# EAGLE design 01-mcu (EAGLE 9.0.0)
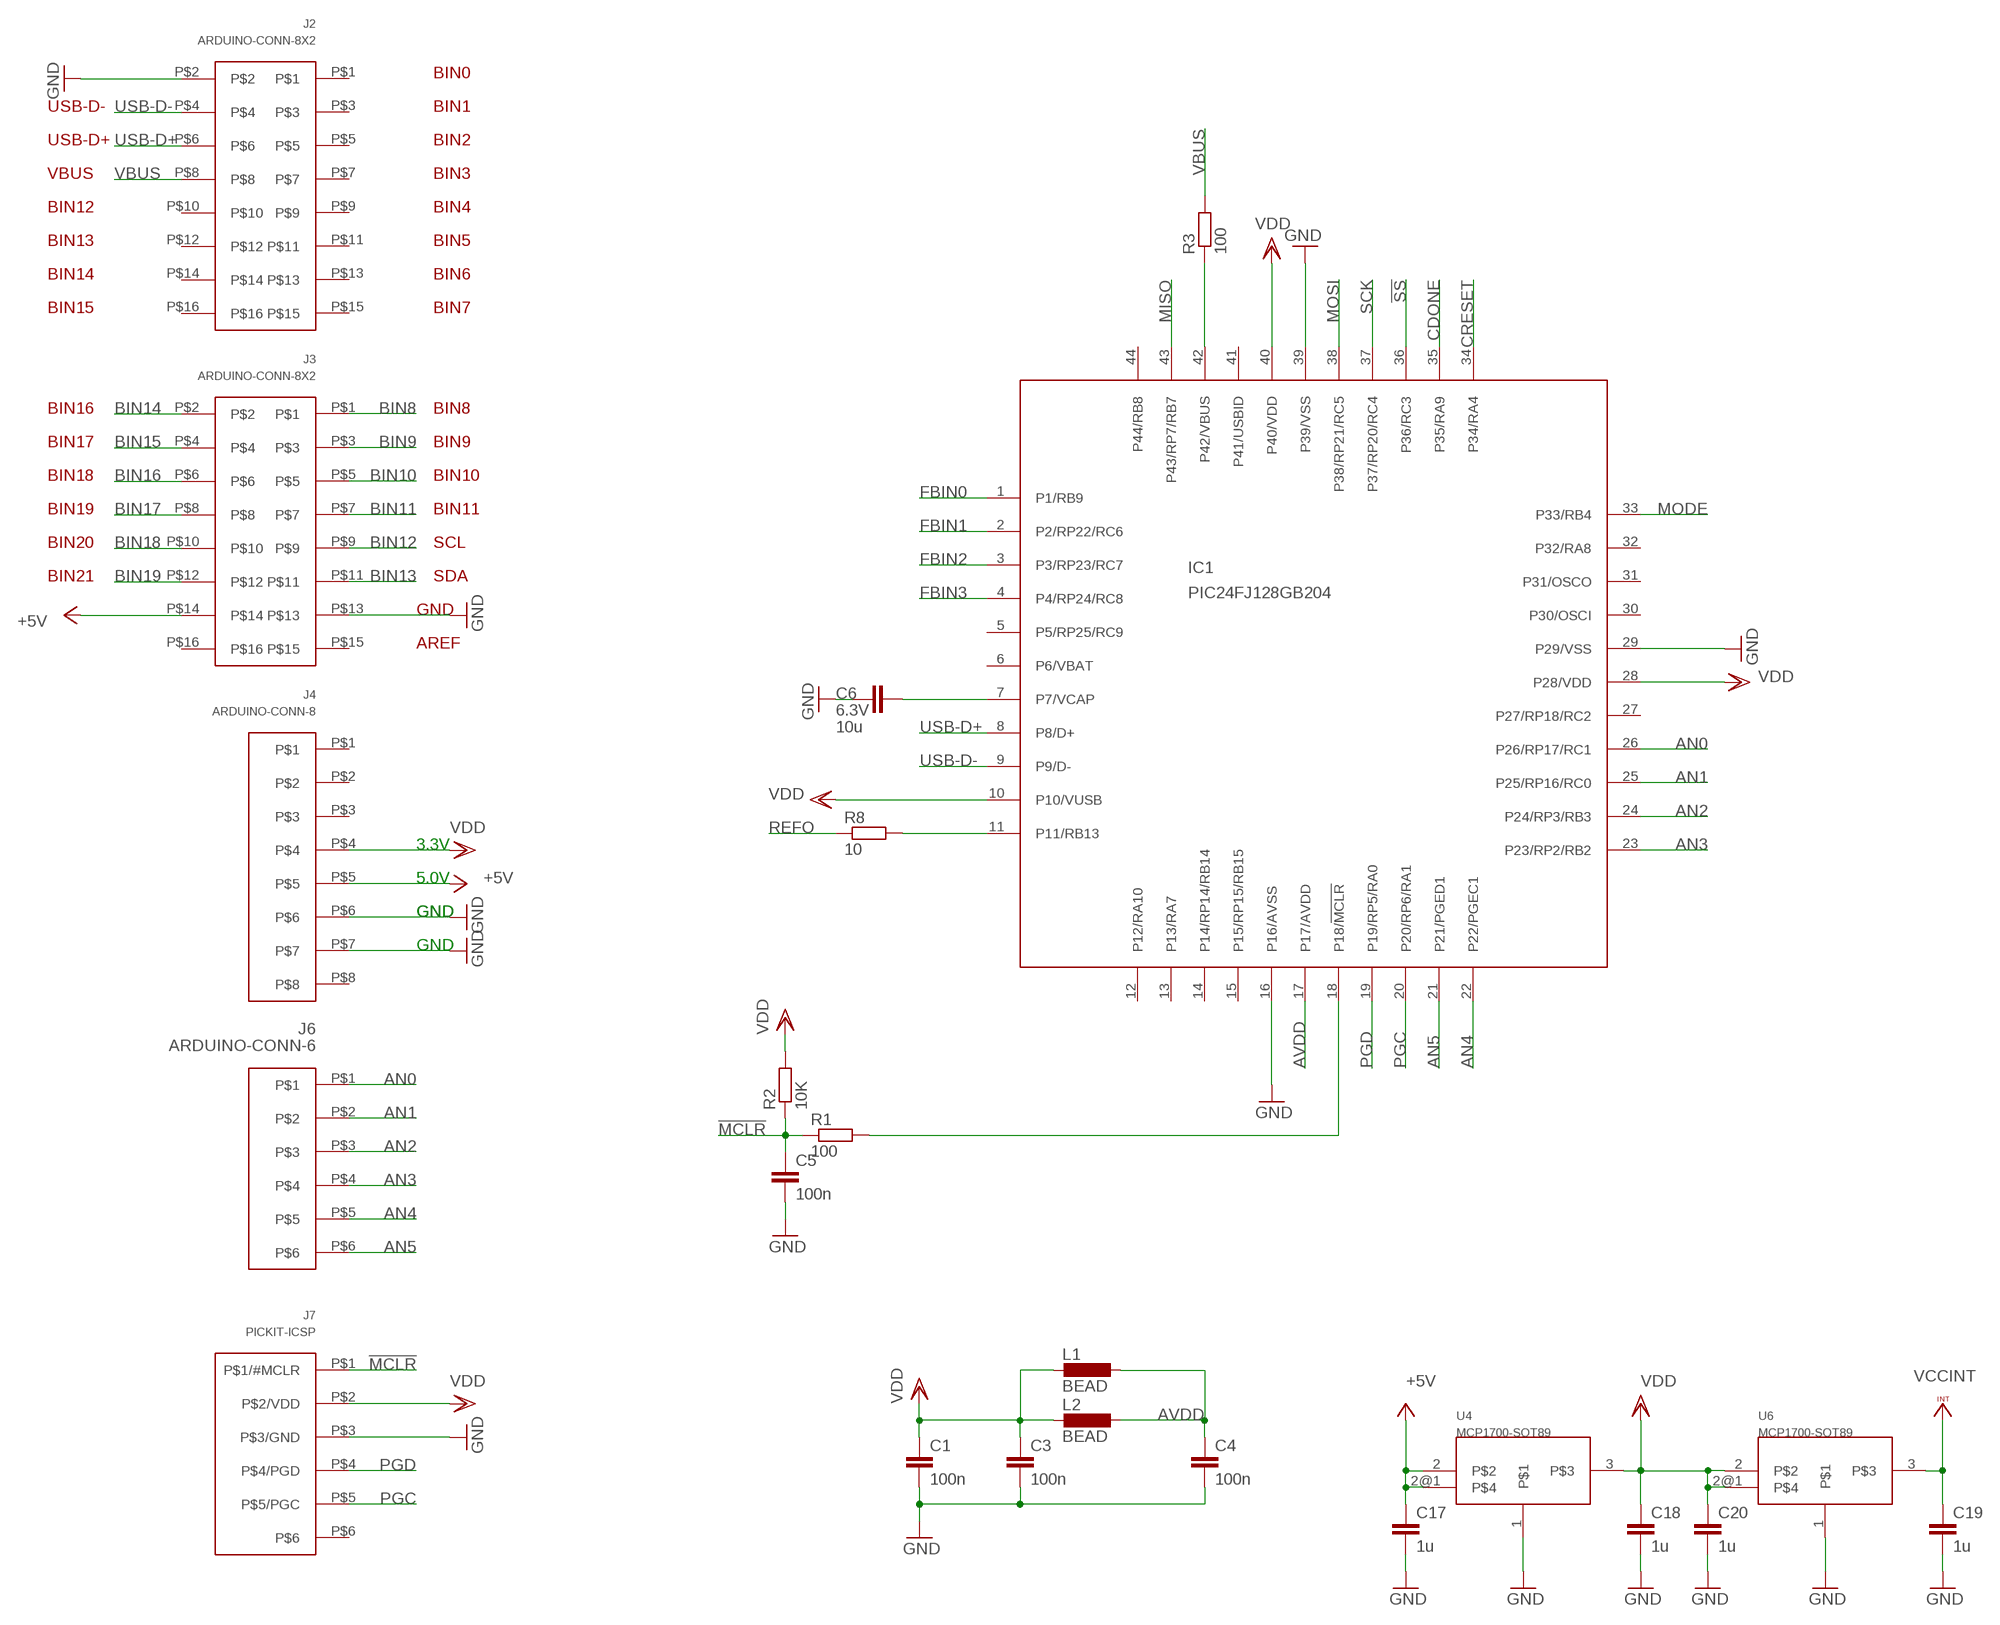
[diagram p0: schematic, sheet 1, part 1 of 2]
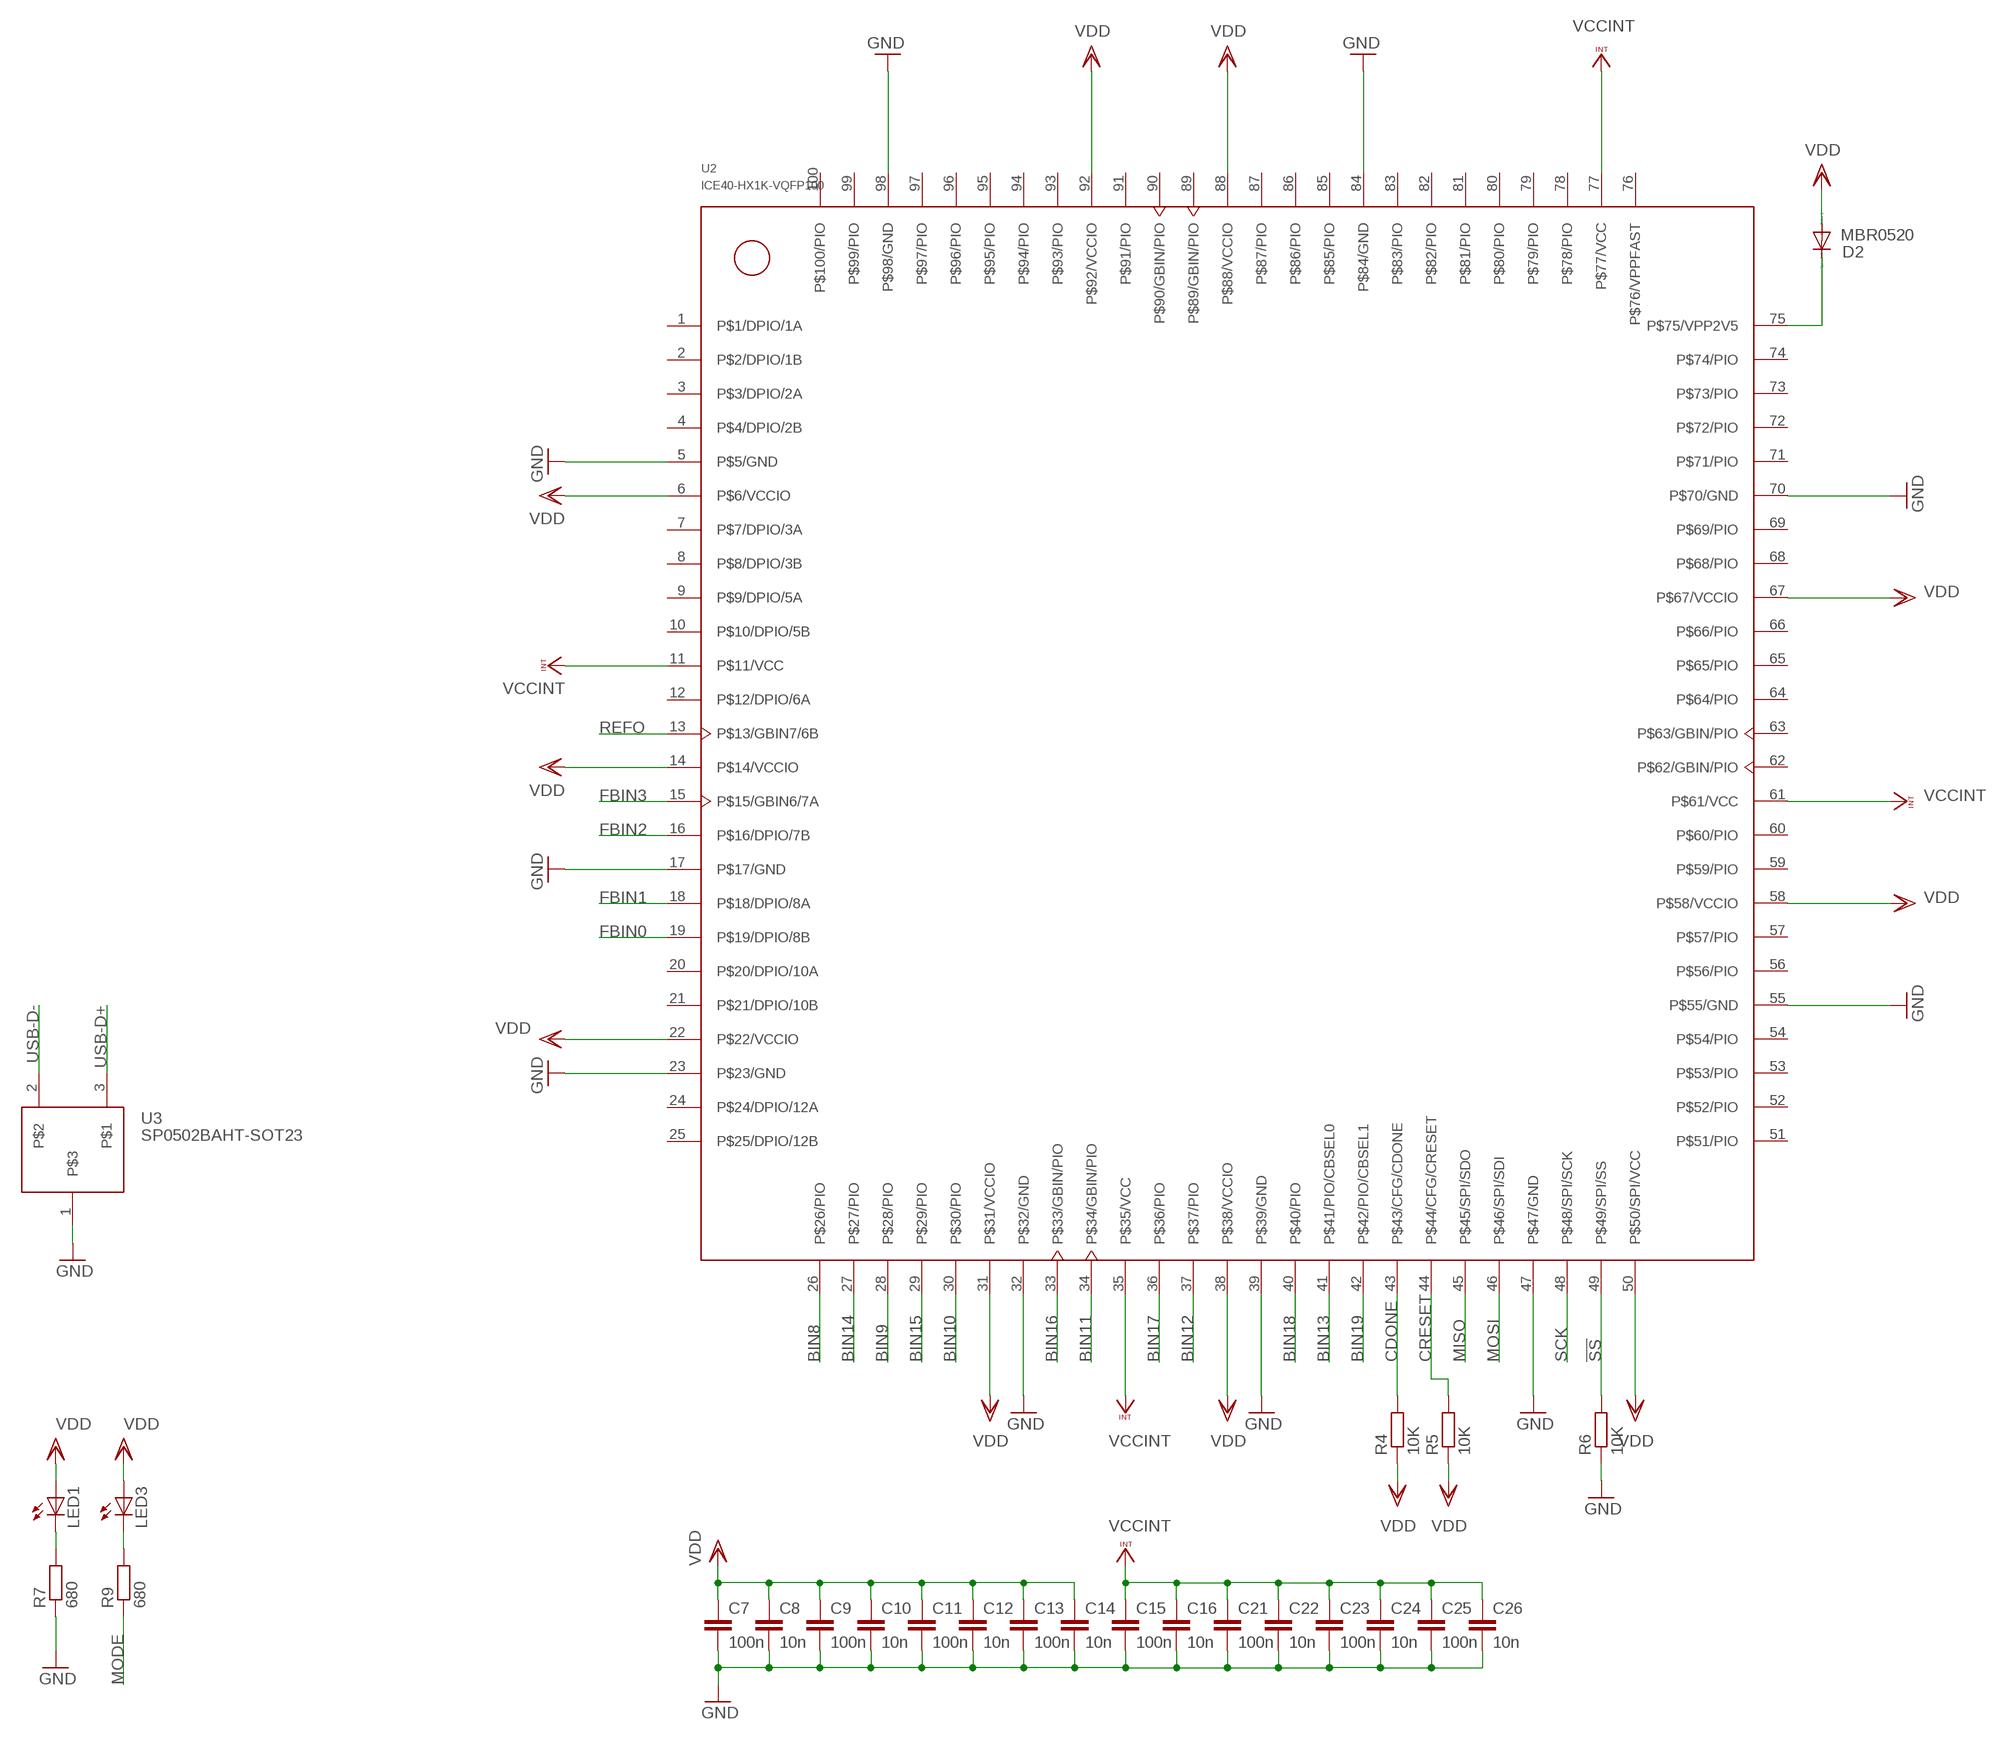
[diagram p1: schematic, sheet 1, part 2 of 2]

## Parts
C1  100n  C-EUC0805  [C0805]
C3  100n  C-EUC0805  [C0805]
C4  100n  C-EUC0805  [C0805]
C5  100n  C-EUC0805  [C0805]
C6  10u  C-EUC0805  [C0805]
C7  100n  C-EUC0805  [C0805]
C8  10n  C-EUC0805  [C0805]
C9  100n  C-EUC0805  [C0805]
C10  10n  C-EUC0805  [C0805]
C11  100n  C-EUC0805  [C0805]
C12  10n  C-EUC0805  [C0805]
C13  100n  C-EUC0805  [C0805]
C14  10n  C-EUC0805  [C0805]
C15  100n  C-EUC0805  [C0805]
C16  10n  C-EUC0805  [C0805]
C17  1u  C-EUC0805  [C0805]
C18  1u  C-EUC0805  [C0805]
C19  1u  C-EUC0805  [C0805]
C20  1u  C-EUC0805  [C0805]
C21  100n  C-EUC0805  [C0805]
C22  10n  C-EUC0805  [C0805]
C23  100n  C-EUC0805  [C0805]
C24  10n  C-EUC0805  [C0805]
C25  100n  C-EUC0805  [C0805]
C26  10n  C-EUC0805  [C0805]
D2  MBR0520  [MBR0520-SOD-123_MINI-SMA]
IC1  PIC24FJ128GB204  [TQFP44]
J2  ARDUINO-CONN-8X2  [ARDUINO-CONN-8X2]
J3  ARDUINO-CONN-8X2  [ARDUINO-CONN-8X2]
J4  ARDUINO-CONN-8  [ARDUINO-CONN-8]
J6  ARDUINO-CONN-6  [ARDUINO-CONN-6]
J7  PICKIT-ICSP  [PICKIT-ICSP]
L1  BEAD  [L0805]
L2  BEAD  [L0805]
LED1  LEDCHIP-LED0805  [CHIP-LED0805]
LED3  LEDCHIP-LED0805  [CHIP-LED0805]
R1  100  R-EU_R0805  [R0805]
R2  10K  R-EU_R0805  [R0805]
R3  100  R-EU_R0805  [R0805]
R4  10K  R-EU_R0805  [R0805]
R5  10K  R-EU_R0805  [R0805]
R6  10K  R-EU_R0805  [R0805]
R7  680  R-EU_R0805  [R0805]
R8  10  R-EU_R0805  [R0805]
R9  680  R-EU_R0805  [R0805]
U2  ICE40-HX1K-VQFP100  [TQFP100-14X14]
U3  SP0502BAHT-SOT23  [SOT23]
U4  MCP1700-SOT89  [MCP1700-SOT89]
U6  MCP1700-SOT89  [MCP1700-SOT89]

## Nets
!MCLR: C5.1 J7.P$1(P$1/#MCLR) R1.1 R2.1
!SS: IC1.36(P36/RC3) R6.2 U2.49(P$49/SPI/SS)
+5V: C17.1 J3.P$14 J4.P$5 U4.2 U4.2@1
AN0: IC1.26(P26/RP17/RC1) J6.P$1
AN1: IC1.25(P25/RP16/RC0) J6.P$2
AN2: IC1.24(P24/RP3/RB3) J6.P$3
AN3: IC1.23(P23/RP2/RB2) J6.P$4
AN4: IC1.22(P22/PGEC1) J6.P$5
AN5: IC1.21(P21/PGED1) J6.P$6
AVDD: C4.1 IC1.17(P17/AVDD) L1.2 L2.2
BIN8: J3.P$1 U2.26(P$26/PIO)
BIN9: J3.P$3 U2.28(P$28/PIO)
BIN10: J3.P$5 U2.30(P$30/PIO)
BIN11: J3.P$7 U2.34(P$34/GBIN/PIO)
BIN12: J3.P$9 U2.37(P$37/PIO)
BIN13: J3.P$11 U2.41(P$41/PIO/CBSEL0)
BIN14: J3.P$2 U2.27(P$27/PIO)
BIN15: J3.P$4 U2.29(P$29/PIO)
BIN16: J3.P$6 U2.33(P$33/GBIN/PIO)
BIN17: J3.P$8 U2.36(P$36/PIO)
BIN18: J3.P$10 U2.40(P$40/PIO)
BIN19: J3.P$12 U2.42(P$42/PIO/CBSEL1)
CDONE: IC1.35(P35/RA9) R4.2 U2.43(P$43/CFG/CDONE)
CRESET: IC1.34(P34/RA4) R5.2 U2.44(P$44/CFG/CRESET)
FBIN0: IC1.1(P1/RB9) U2.19(P$19/DPIO/8B)
FBIN1: IC1.2(P2/RP22/RC6) U2.18(P$18/DPIO/8A)
FBIN2: IC1.3(P3/RP23/RC7) U2.16(P$16/DPIO/7B)
FBIN3: IC1.4(P4/RP24/RC8) U2.15(P$15/GBIN6/7A)
GND: C1.2 C3.2 C4.2 C5.2 C6.1 C7.2 C8.2 C9.2 C10.2 C11.2 C12.2 C13.2 C14.2 C15.2 C16.2 C17.2 C18.2 C19.2 C20.2 C21.2 C22.2 C23.2 C24.2 C25.2 C26.2 IC1.16(P16/AVSS) IC1.29(P29/VSS) IC1.39(P39/VSS) J2.P$2 J3.P$13 J4.P$6 J4.P$7 J7.P$3(P$3/GND) R6.1 R7.1 U2.5(P$5/GND) U2.17(P$17/GND) U2.23(P$23/GND) U2.32(P$32/GND) U2.39(P$39/GND) U2.47(P$47/GND) U2.55(P$55/GND) U2.70(P$70/GND) U2.84(P$84/GND) U2.98(P$98/GND) U3.1 U4.1 U6.1
MISO: IC1.43(P43/RP7/RB7) U2.45(P$45/SPI/SDO)
MODE: IC1.33(P33/RB4) R9.1
MOSI: IC1.38(P38/RP21/RC5) U2.46(P$46/SPI/SDI)
N$1: IC1.42(P42/VBUS) R3.1
N$2: D2.C U2.75(P$75/VPP2V5)
N$3: IC1.18(P18/!MCLR) R1.2
N$4: IC1.11(P11/RB13) R8.2
N$5: C6.2 IC1.7(P7/VCAP)
N$8: LED1.C R7.2
N$11: LED3.C R9.2
PGC: IC1.20(P20/RP6/RA1) J7.P$5(P$5/PGC)
PGD: IC1.19(P19/RP5/RA0) J7.P$4(P$4/PGD)
REFO: R8.1 U2.13(P$13/GBIN7/6B)
SCK: IC1.37(P37/RP20/RC4) U2.48(P$48/SPI/SCK)
USB-D+: IC1.8(P8/D+) J2.P$6 U3.3
USB-D-: IC1.9(P9/D-) J2.P$4 U3.2
VBUS: J2.P$8 R3.2
VCCINT: C15.1 C16.1 C19.1 C21.1 C22.1 C23.1 C24.1 C25.1 C26.1 U2.11(P$11/VCC) U2.35(P$35/VCC) U2.61(P$61/VCC) U2.77(P$77/VCC) U6.3
VDD: C1.1 C3.1 C7.1 C8.1 C9.1 C10.1 C11.1 C12.1 C13.1 C14.1 C18.1 C20.1 D2.A IC1.10(P10/VUSB) IC1.28(P28/VDD) IC1.40(P40/VDD) J4.P$4 J7.P$2(P$2/VDD) L1.1 L2.1 LED1.A LED3.A R2.2 R4.1 R5.1 U2.6(P$6/VCCIO) U2.14(P$14/VCCIO) U2.22(P$22/VCCIO) U2.31(P$31/VCCIO) U2.38(P$38/VCCIO) U2.50(P$50/SPI/VCC) U2.58(P$58/VCCIO) U2.67(P$67/VCCIO) U2.88(P$88/VCCIO) U2.92(P$92/VCCIO) U4.3 U6.2 U6.2@1
Unconnected: IC1.5(P5/RP25/RC9) IC1.6(P6/VBAT) IC1.12(P12/RA10) IC1.13(P13/RA7) IC1.14(P14/RP14/RB14) IC1.15(P15/RP15/RB15) IC1.27(P27/RP18/RC2) IC1.30(P30/OSCI) IC1.31(P31/OSCO) IC1.32(P32/RA8) IC1.41(P41/USBID) IC1.44(P44/RB8) J2.P$1 J2.P$3 J2.P$5 J2.P$7 J2.P$9 J2.P$10 J2.P$11 J2.P$12 J2.P$13 J2.P$14 J2.P$15 J2.P$16 J3.P$15 J3.P$16 J4.P$1 J4.P$2 J4.P$3 J4.P$8 J7.P$6 U2.1(P$1/DPIO/1A) U2.2(P$2/DPIO/1B) U2.3(P$3/DPIO/2A) U2.4(P$4/DPIO/2B) U2.7(P$7/DPIO/3A) U2.8(P$8/DPIO/3B) U2.9(P$9/DPIO/5A) U2.10(P$10/DPIO/5B) U2.12(P$12/DPIO/6A) U2.20(P$20/DPIO/10A) U2.21(P$21/DPIO/10B) U2.24(P$24/DPIO/12A) U2.25(P$25/DPIO/12B) U2.51(P$51/PIO) U2.52(P$52/PIO) U2.53(P$53/PIO) U2.54(P$54/PIO) U2.56(P$56/PIO) U2.57(P$57/PIO) U2.59(P$59/PIO) U2.60(P$60/PIO) U2.62(P$62/GBIN/PIO) U2.63(P$63/GBIN/PIO) U2.64(P$64/PIO) U2.65(P$65/PIO) U2.66(P$66/PIO) U2.68(P$68/PIO) U2.69(P$69/PIO) U2.71(P$71/PIO) U2.72(P$72/PIO) U2.73(P$73/PIO) U2.74(P$74/PIO) U2.76(P$76/VPPFAST) U2.78(P$78/PIO) U2.79(P$79/PIO) U2.80(P$80/PIO) U2.81(P$81/PIO) U2.82(P$82/PIO) U2.83(P$83/PIO) U2.85(P$85/PIO) U2.86(P$86/PIO) U2.87(P$87/PIO) U2.89(P$89/GBIN/PIO) U2.90(P$90/GBIN/PIO) U2.91(P$91/PIO) U2.93(P$93/PIO) U2.94(P$94/PIO) U2.95(P$95/PIO) U2.96(P$96/PIO) U2.97(P$97/PIO) U2.99(P$99/PIO) U2.100(P$100/PIO)

## Notes on the sheet
- BIN0
- USB-D- | BIN1
- USB-D+ | BIN2
- VBUS | BIN3
- BIN12 | BIN4
- BIN13 | BIN5
- BIN14 | BIN6
- BIN15 | BIN7
- BIN16 | BIN8
- BIN17 | BIN9
- BIN18 | BIN10
- BIN19 | BIN11
- BIN20 | SCL
- BIN21 | SDA
- GND
- AREF
- 3.3V
- 5.0V
- GND | GND
- GND

## Library data of the parts
C1 C3-C5 C7-C26 = rcl:C-EU: CAPACITOR, European symbol; SPICEPREFIX: C
C6 = rcl:C-EU: CAPACITOR, European symbol; RATING: 6.3V; SPICEPREFIX: C
D2 = MIDI router MCU parts:MBR0520
IC1 = MIDI router MCU parts:PIC24FJ128GB204: PIC24FJ64GA00416-bit microcontroller Auto generated by make-symbol-device-package-bsdl.ulp Rev. 25 Source: PIC24FJ64GA004.bsd
J2 J3 = MIDI router MCU parts:ARDUINO-CONN-8X2
J4 = MIDI router MCU parts:ARDUINO-CONN-8
J6 = MIDI router MCU parts:ARDUINO-CONN-6
J7 = MIDI router MCU parts:PICKIT-ICSP
L1 L2 = MIDI router MCU parts:BEAD
LED1 LED3 = MIDI router MCU parts:LED: LED OSRAM: - CHIPLED LG R971, LG N971, LY N971, LG Q971, LY Q971, LO R971, LY R971 LH N974, LH R974 LS Q976, LO Q976, LY Q976 LO Q996 - Hyper CHIPLED LW Q18S LB Q993, LB Q99A, LB R99A - SideLED LS A670, LO A670, LY A670, LG A670, LP A670 LB A673, LV A673, LT A673, LW A673 LH A674 LY A675 LS A676, LA A676, LO A676, LY A676, LW A676 LS A679, LY A679, LG A679 - Hyper Micro SIDELED® LS Y876, LA Y876, LO Y876, LY Y876 LT Y87S - SmartLED LW L88C, LW L88S LB L89C, LB L89S, LG L890 LS L89K, LO L89K, LY L89K LS L896, LA L896, LO L896, LY L896 - TOPLED LS T670, LO T670, LY T670, LG T670, LP T670 LSG T670, LSP T670, LSY T670, LOP T670, LYG T670 LG T671, LOG T671, LSG T671 LB T673, LV T673, LT T673, LW T673 LH T674 LS T676, LA T676, LO T676, LY T676, LB T676, LH T676, LSB T676, LW T676 LB T67C, LV T67C, LT T67C, LS T67K, LO T67K, LY T67K, LW E67C LS E67B, LA E67B, LO E67B, LY E67B, LB E67C, LV E67C, LT E67C LW T67C LS T679, LY T679, LG T679 LS T770, LO T770, LY T770, LG T770, LP T770 LB T773, LV T773, LT T773, LW T773 LH T774 LS E675, LA E675, LY E675, LS T675 LS T776, LA T776, LO T776, LY T776, LB T776 LHGB T686 LT T68C, LB T68C - Hyper Mini TOPLED® LB M676 - Mini TOPLED Santana® LG M470 LS M47K, LO M47K, LY M47K Source: http://www.osram.convergy.de LUXEON: - LUMILED® LXK2-PW12-R00, LXK2-PW12-S00, LXK2-PW14-U00, LXK2-PW14-V00 LXK2-PM12-R00, LXK2-PM12-S00, LXK2-PM14-U00 LXK2-PE12-Q00, LXK2-PE12-R00, LXK2-PE12-S00, LXK2-PE14-T00, LXK2-PE14-U00 LXK2-PB12-K00, LXK2-PB12-L00, LXK2-PB12-M00, LXK2-PB14-N00, LXK2-PB14-P00, LXK2-PB14-Q00 LXK2-PR12-L00, LXK2-PR12-M00, LXK2-PR14-Q00, LXK2-PR14-R00 LXK2-PD12-Q00, LXK2-PD12-R00, LXK2-PD12-S00 LXK2-PH12-R00, LXK2-PH12-S00 LXK2-PL12-P00, LXK2-PL12-Q00, LXK2-PL12-R00 Source: www.luxeon.com KINGBRIGHT: KA-3528ASYC Source: www.kingbright.com
R1-R9 = rcl:R-EU_: RESISTOR, European symbol
U2 = MIDI router MCU parts:ICE40-HX1K-VQFP100
U3 = MIDI router MCU parts:SP0502BAHT-SOT23
U4 U6 = MIDI router MCU parts:MCP1700-SOT89

## Board
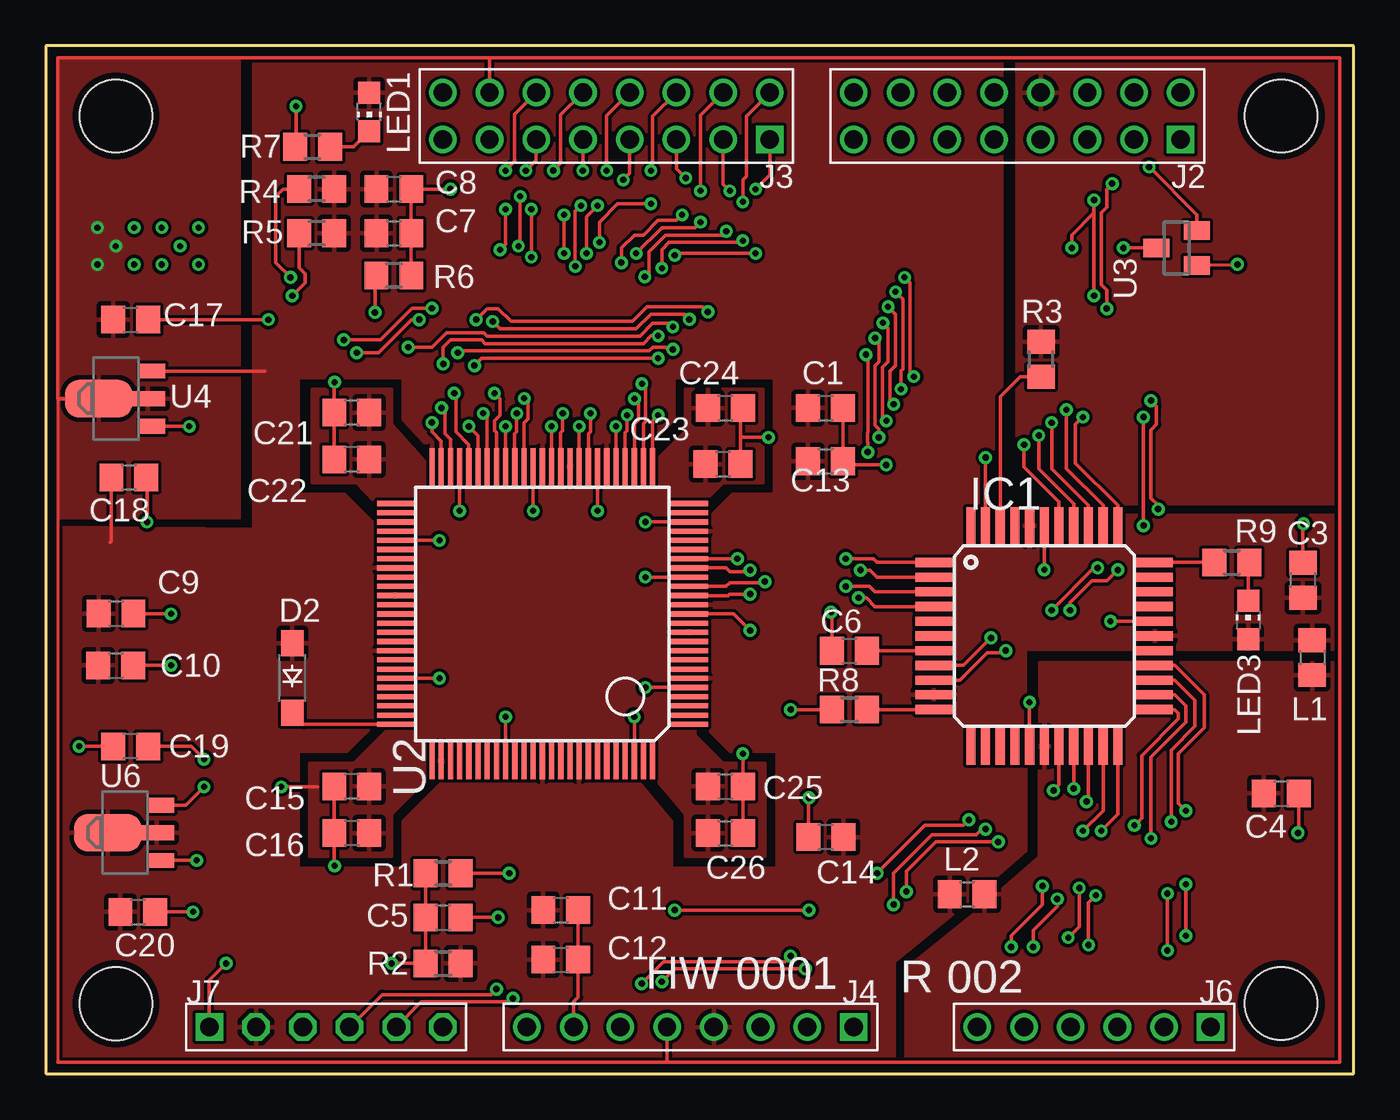
[diagram p2: board, top side]
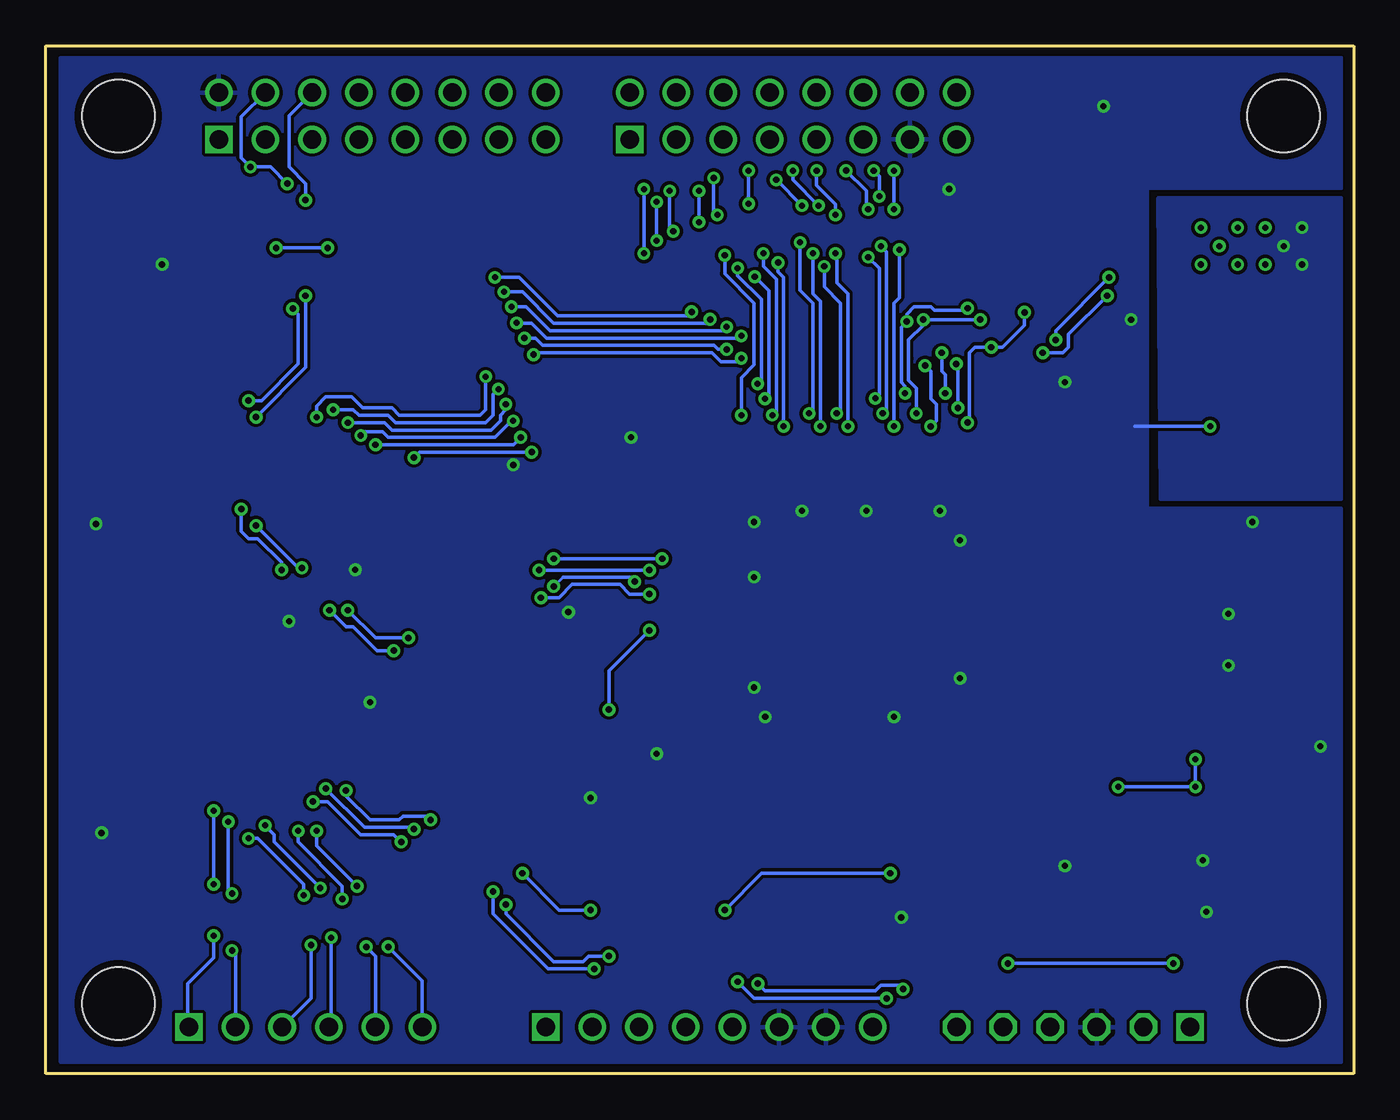
[diagram p3: board, bottom side, seen from below]

Size 71.12 x 55.88 mm. Coordinates in mm from the lower left corner, seen from the top.
Outline: 0,0 71.12,0 71.12,55.88 0,55.88 0,0
Copper layers (1*16): Top 0.0356mm / dielectric 1.5011mm / Bottom 0.0356mm
Design rules "LaenPCBOrder-custom": minimum track width 6mil, minimum drill 13mil, track to track 7mil, track to pad 7mil, pad to pad 7mil, via to via 7mil, smd to smd 7mil, copper to edge 15mil, drill to drill 6mil, minimum pad ring 7mil, minimum via ring 7mil, stop-mask expansion 3mil, vias tented up to drill 0mil, thermal gap 10mil
Holes 3.96 mm at 3.81,52.07 3.81,3.81 67.18,3.82 67.18,52.07

### Footprints (pad centres in the part's own frame; a part is rotated, then mirrored left to right if it is on the bottom)
C0805 = smd 1.3 x 1.5: 1 -0.95,0; 2 0.95,0
MBR0520-SOD-123_MINI-SMA = smd 1.422 x 1.219: A 1.778,0; C -2.007,0
TQFP44 = smd 2 x 0.5: 1 -6,4; 2 -6,3.2; 3 -6,2.4; 4 -6,1.6; 5 -6,0.8; 6 -6,0; 7 -6,-0.8; 8 -6,-1.6; 9 -6,-2.4; 10 -6,-3.2; 11 -6,-4; 23 6,-4; 24 6,-3.2; 25 6,-2.4; 26 6,-1.6; 27 6,-0.8; 28 6,0; 29 6,0.8; 30 6,1.6; 31 6,2.4; 32 6,3.2; 33 6,4 | smd 0.5 x 2: 12 -4,-6; 13 -3.2,-6; 14 -2.4,-6; 15 -1.6,-6; 16 -0.8,-6; 17 0,-6; 18 0.8,-6; 19 1.6,-6; 20 2.4,-6; 21 3.2,-6; 22 4,-6; 34 4,6; 35 3.2,6; 36 2.4,6; 37 1.6,6; 38 0.8,6; 39 0,6; 40 -0.8,6; 41 -1.6,6; 42 -2.4,6; 43 -3.2,6; 44 -4,6
ARDUINO-CONN-8X2 = drill 1 square: P$1 0,0 | drill 1: P$2 0,-2.54; P$3 2.54,0; P$4 2.54,-2.54; P$5 5.08,0; P$6 5.08,-2.54; P$7 7.62,0; P$8 7.62,-2.54; P$9 10.16,0; P$10 10.16,-2.54; P$11 12.7,0; P$12 12.7,-2.54; P$13 15.24,0; P$14 15.24,-2.54; P$15 17.78,0; P$16 17.78,-2.54
ARDUINO-CONN-8 = drill 1 square: P$1 0,0 | drill 1: P$2 2.54,0; P$3 5.08,0; P$4 7.62,0; P$5 10.16,0; P$6 12.7,0; P$7 15.24,0; P$8 17.78,0
ARDUINO-CONN-6 = drill 1 square: P$1 0,0 | drill 1: P$2 2.54,0; P$3 5.08,0; P$4 7.62,0; P$5 10.16,0; P$6 12.7,0
PICKIT-ICSP = drill 1 square: P$1 0,0 | drill 1 octagon: P$2 0,-2.54; P$3 0,-5.08; P$4 0,-7.62; P$5 0,-10.16; P$6 0,-12.7
L0805 = smd 1.3 x 1.5: 1 -0.95,0; 2 0.95,0
CHIP-LED0805 = smd 1.2 x 1.2: A 0,-1.05; C 0,1.05
R0805 = smd 1.3 x 1.5: 1 -0.95,0; 2 0.95,0
TQFP100-14X14 = smd 0.28 x 2: 1 -6,-8; 2 -5.5,-8; 3 -5,-8; 4 -4.5,-8; 5 -4,-8; 6 -3.5,-8; 7 -3,-8; 8 -2.5,-8; 9 -2,-8; 10 -1.5,-8; 11 -1,-8; 12 -0.5,-8; 13 0,-8; 14 0.5,-8; 15 1,-8; 16 1.5,-8; 17 2,-8; 18 2.5,-8; 19 3,-8; 20 3.5,-8; 21 4,-8; 22 4.5,-8; 23 5,-8; 24 5.5,-8; 25 6,-8; 51 6,8; 52 5.5,8; 53 5,8; 54 4.5,8; 55 4,8; 56 3.5,8; 57 3,8; 58 2.5,8; 59 2,8; 60 1.5,8; 61 1,8; 62 0.5,8; 63 0,8; 64 -0.5,8; 65 -1,8; 66 -1.5,8; 67 -2,8; 68 -2.5,8; 69 -3,8; 70 -3.5,8; 71 -4,8; 72 -4.5,8; 73 -5,8; 74 -5.5,8; 75 -6,8 | smd 2 x 0.28: 26 8,-6; 27 8,-5.5; 28 8,-5; 29 8,-4.5; 30 8,-4; 31 8,-3.5; 32 8,-3; 33 8,-2.5; 34 8,-2; 35 8,-1.5; 36 8,-1; 37 8,-0.5; 38 8,0; 39 8,0.5; 40 8,1; 41 8,1.5; 42 8,2; 43 8,2.5; 44 8,3; 45 8,3.5; 46 8,4; 47 8,4.5; 48 8,5; 49 8,5.5; 50 8,6; 76 -8,6; 77 -8,5.5; 78 -8,5; 79 -8,4.5; 80 -8,4; 81 -8,3.5; 82 -8,3; 83 -8,2.5; 84 -8,2; 85 -8,1.5; 86 -8,1; 87 -8,0.5; 88 -8,0; 89 -8,-0.5; 90 -8,-1; 91 -8,-1.5; 92 -8,-2; 93 -8,-2.5; 94 -8,-3; 95 -8,-3.5; 96 -8,-4; 97 -8,-4.5; 98 -8,-5; 99 -8,-5.5; 100 -8,-6
SOT23 = smd 1 x 1.4: 1 -0.95,-1.1; 2 0.95,-1.1; 3 0,1.1
MCP1700-SOT89 = smd 0.8 x 1.4: 1 -1.499,-1.981; 3 1.499,-1.981 | smd 0.8 x 1.9: 2 0,-1.727 | smd 2.032 x 3.65: 2@1 0,0.94

### Placement (x,y rotation side)
C1  42.4,36.2 0 top
C3  68.37,26.84 90 top
C4  67.18,15.24 0 top
C5  21.6,8.5 0 top
C6  43.7,23 0 top
C7  18.92,45.7 0 top
C8  18.92,48.1 0 top
C9  3.81,25.02 0 top
C10  3.8,22.2 0 top
C11  28,8.9 0 top
C12  28,6.2 0 top
C13  42.4,33.3 0 top
C14  42.42,12.86 180 top
C15  16.64,15.62 180 top
C16  16.64,13.08 180 top
C17  4.6,41 0 top
C18  4.51,32.43 0 top
C19  4.6,17.8 180 top
C20  5,8.8 0 top
C21  16.64,35.94 180 top
C22  16.64,33.4 180 top
C23  36.83,33.15 0 top
C24  36.96,36.2 0 top
C25  36.96,15.62 0 top
C26  36.96,13.08 0 top
D2  13.4,21.63 90 top
IC1  54.3,23.8 0 top
J2  61.72,50.8 180 top
J3  39.37,50.8 180 top
J4  43.94,2.54 180 top
J6  63.35,2.54 180 top
J7  8.89,2.54 90 top
L1  68.87,22.63 270 top
L2  50.1,9.76 0 top
LED1  17.59,52.3 180 top
LED3  65.39,24.67 0 top
R1  21.6,10.9 0 top
R2  21.6,6 0 top
R3  54.12,38.85 90 top
R4  14.72,48.1 180 top
R5  14.72,45.7 180 top
R6  18.92,43.4 180 top
R7  14.5,50.4 0 top
R8  43.7,19.8 0 top
R9  64.5,27.8 0 top
U2  27,25 90 top
U3  61.5,44.9 90 top
U4  3.81,36.7 90 top
U6  4.3,13.1 90 top

### Tracks (layer width: path | path; a pad name or v marks a point on that pad's centre or on a via)
!MCLR  (via drill 0.35)
  Top 0.178: J7.P$1 8.89,5.09 v9.8,6 | v18.8,6 R2.1 C5.1 R1.1
  Bottom 0.178: v9.8,6 v18.8,6
!SS  (via drill 0.33, 0.35)
  Top 0.178: IC1.36 56.7,30.9 54.7,32.9 v54.7,35.4 | v46.11,36.4 45.9,36.61 45.9,38.2 46.2,38.5 46.2,41.3 v45.8,41.7 | v34.1,40.61 33.91,40.8 33,40.8 32.3,40.1 24,40.1 23.8,40.3 21.8,40.3 21,39.5 v19.7,39.5 | U2.49 21.5,34.4 21,34.9 v21,35.4 | R6.2 17.9,43.33 v17.9,41.4
  Bottom 0.178: v54.7,35.4 52.7,35.4 52.3,35 46.9,35 46.4,35.5 46.4,35.8 46.11,36.09 v46.11,36.4 | v45.8,41.7 45,41.7 43.7,40.4 34.31,40.4 v34.1,40.61 | v21,35.4 20.9,35.5 20.9,39.2 20.6,39.5 v19.7,39.5 19.1,39.5 17.9,40.7 v17.9,41.4
+5V  (via drill 0.33)
  Top 0.152: 0.64,36.7 0.64,0.64
  Top 0.178: J3.P$14 24.13,55.24 | 24.13,55.24 0.64,55.24 0.64,36.7 U4.2@1 | 0.64,0.64 33.8,0.64 | 33.8,0.64 70.36,0.64 70.36,55.24 24.13,55.24 | J4.P$5 33.78,0.65 33.8,0.64
  other vias: 3.8,45 2.8,46 2.8,44
  pour Top: 10.54,55.24 0.64,55.24 0.64,30.23 10.54,30.23
  pour Bottom: 0.64,47.62 10.67,47.62 10.54,31.24 0.64,31.24
+5V1  (via drill 0.33)
  other vias: 4.8,46 4.8,44
+5V2  (via drill 0.33)
  other vias: 7.3,45 6.3,46 6.3,44
+5V3  (via drill 0.33)
  other vias: 8.3,46 8.3,44
AN0  (via drill 0.33)
  Top 0.178: IC1.26 61.4,22.2 63,20.6 63,18.8 61.6,17.4 61.6,14.7 v62,14.3 | v62,10.3 v62,7.5
  Bottom 0.178: v62,14.3 v62,10.3 | v62,7.5 62,6.3 63.4,4.9 63.4,2.59 J6.P$1
AN1  (via drill 0.33)
  Top 0.178: IC1.25 61.4,21.4 62.5,20.3 62.5,18.9 61.2,17.6 v61.2,13.7 | v61,9.8 v61,6.7
  Bottom 0.178: v61.2,13.7 61.2,10 v61,9.8 | v61,6.7 60.81,6.51 J6.P$2
AN2  (via drill 0.33)
  Top 0.178: IC1.24 61.4,20.6 62,20 62,19.1 60.1,17.2 v60.1,12.8 | v57.1,9.7 56.7,9.3 v56.7,7
  Bottom 0.178: v60.1,12.8 59.6,12.8 57.1,10.3 v57.1,9.7 | v56.7,7 56.7,4.11 J6.P$3
AN3  (via drill 0.33)
  Top 0.178: IC1.23 61.4,19.8 61.6,19.6 61.6,19.3 59.6,17.3 59.6,13.9 v59.2,13.5 | v56.2,10.1 56.2,8 v55.6,7.4
  Bottom 0.178: v56.2,10.1 58.7,12.6 58.7,13 v59.2,13.5 | v55.6,7.4 55.6,2.67 J6.P$4
AN4  (via drill 0.33, 0.35)
  Top 0.178: IC1.22 58.3,14.1 v57.4,13.2 | v53.7,6.9 53.7,7.8 55,9.1 v55,9.5
  Bottom 0.178: J6.P$5 53.19,6.39 v53.7,6.9 | v55,9.5 55,10.2 57.4,12.6 v57.4,13.2
AN5  (via drill 0.33, 0.35)
  Top 0.178: IC1.21 57.5,14.3 v56.4,13.2 | v52.5,6.9 52.5,7.5 54.2,9.2 v54.2,10.2
  Bottom 0.178: J6.P$6 50.65,5.05 v52.5,6.9 | v54.2,10.2 56.4,12.4 v56.4,13.2
AVDD
  pour Top: 46.78,0.64 46.78,5.71 50.43,8.66 54.03,11.8 54.07,22.34 70.36,22.34 70.36,0.64
BIN8  (via drill 0.33)
  Top 0.178: U2.26 33,35.5 v33.3,35.8 | J3.P$1 39.37,48.87 v38.6,48.1 | v38.6,44.6 34.3,44.6 v34.2,44.5
  Bottom 0.178: v33.3,35.8 33.3,37.85 32.6,38.55 32.6,41.9 34.2,43.5 v34.2,44.5 | v38.6,48.1 v38.6,44.6
BIN9  (via drill 0.33)
  Top 0.178: U2.28 32,35.34 32.22,35.56 32.22,36.49 v32.01,36.7 | J3.P$3 36.83,48.37 v37.2,48 | v37,45.81 36.79,45.6 33.7,45.6 32.8,44.7 32.8,43.56 v32.57,43.33
  Bottom 0.178: v32.01,36.7 31.8,36.91 31.8,42.56 v32.57,43.33 | v37.2,48 37.2,46.01 v37,45.81
BIN10  (via drill 0.33, 0.35)
  Top 0.178: U2.30 v31,35.2 | J3.P$5 34.29,49.21 v34.8,48.7 | v34.6,46.7 34.3,46.4 33.3,46.4 32.5,45.6 32,45.6 31.3,44.9 v31.3,44.1
  Bottom 0.178: v34.8,48.7 34.8,46.9 v34.6,46.7 | v31.3,44.1 31.3,43.6 31,43.3 v31,35.2
BIN11  (via drill 0.33)
  Top 0.178: U2.34 v29,35.2 | J3.P$7 31.75,48.95 v31.4,48.6 | v30,47.2 29.4,46.6 v29.4,44.6
  Bottom 0.178: v31.4,48.6 v30,47.2 | v29.4,44.6 29.4,42.4 29,42 v29,35.2
BIN12  (via drill 0.33)
  Top 0.178: U2.37 v27.5,35.2 | J3.P$9 v29.2,49.1 | v28.18,46.7 v28.18,44.6
  Bottom 0.178: v29.2,49.1 29.2,48.3 28.18,47.28 v28.18,46.7 | v27.5,35.2 27.5,42.42 28.1,43.02 28.1,44.52 v28.18,44.6
BIN13  (via drill 0.33)
  Top 0.178: v25.61,35.9 v25.6,35.89 25.6,35.46 25.61,35.45 25.61,34.91 25.5,34.8 U2.41 | J3.P$11 26.67,49.67 v26.1,49.1 | v25.79,47.7 25.79,45.09 v25.7,45
  Bottom 0.178: v25.61,35.9 25.4,36.11 25.4,44.7 v25.7,45 | v26.1,49.1 25.79,48.79 v25.79,47.7
BIN14  (via drill 0.33)
  Top 0.178: U2.27 32.5,35.34 32.62,35.46 32.62,37.31 v32.41,37.52 | J3.P$2 38.1,52.07 38.1,48.8 37.9,48.6 v37.9,47.4 | v37.9,45.3 37.8,45.2 33.9,45.2 33.5,44.8 v33.5,43.8
  Bottom 0.178: v32.41,37.52 32.2,37.73 32.2,42.1 33.5,43.4 v33.5,43.8 | v37.9,47.4 v37.9,45.3
BIN15  (via drill 0.33)
  Top 0.178: U2.29 31.5,34.84 31.61,34.95 v31.61,35.81 | J3.P$4 35.6,52.11 v35.6,48 | v35.6,46.3 35.3,46 33.5,46 v32.1,44.6
  Bottom 0.178: v31.61,35.81 31.4,36.02 31.4,43.2 32.1,43.9 v32.1,44.6 | v35.6,48 v35.6,46.3
BIN16  (via drill 0.33)
  Top 0.178: v29.61,35.9 29.61,34.91 29.5,34.8 U2.33 | J3.P$6 33,52.05 33,49.2 v32.9,49.1 | v32.9,47.3 31.1,47.3 30.1,46.3 v30.1,45.2
  Bottom 0.178: v29.61,35.9 29.4,36.11 29.4,41.9 30.1,42.6 v30.1,45.2 | v32.9,49.1 v32.9,47.3
BIN17  (via drill 0.33)
  Top 0.178: U2.36 28,34.84 28.11,34.95 v28.11,35.9 | J3.P$8 30.5,52.09 v30.5,49.1 | v29.1,47.2 28.79,46.89 v28.79,43.9
  Bottom 0.178: v28.11,35.9 27.9,36.11 27.9,41.9 28.79,42.79 v28.79,43.9 | v30.5,49.1 30.5,48.6 v29.1,47.2
BIN18  (via drill 0.33, 0.35)
  Top 0.178: U2.40 26,35.4 26.22,35.62 26.22,36.51 v26.02,36.72 | J3.P$10 28,52.13 28,49.5 v27.6,49.1 | v26.4,47 v26.4,44.4
  Bottom 0.178: v26.02,36.72 25.8,36.93 25.8,43.8 v26.4,44.4 | v26.4,47 26.5,47.1 26.5,48 v27.6,49.1
BIN19  (via drill 0.33)
  Top 0.178: U2.42 v25,35.2 | J3.P$12 25.5,52.17 25.5,49.6 v25,49.1 | v25,47 25,45.1 v24.7,44.8
  Bottom 0.178: v25,35.2 25,41.9 24.7,42.2 v24.7,44.8 | v25,49.1 v25,47
CDONE  (via drill 0.33, 0.35)
  Top 0.178: IC1.35 57.5,30.9 55.5,32.9 v55.5,36.1 | v46.51,37.22 46.51,38.21 46.6,38.3 46.6,42.12 v46.21,42.51 | v24.39,37 24.7,36.69 24.7,35.8 24.39,35.49 24.39,34.95 24.5,34.84 U2.43 | v35,41.02 34.72,41.3 32.9,41.3 32.1,40.5 24.7,40.5 v24.3,40.9 | v21,41.62 19.92,41.62 18.2,39.9 v16.2,39.9 | R4.2 12.9,48.1 12.5,47.7 12.5,44.1 v13.3,43.3
  Bottom 0.178: v55.5,36.1 54.4,36.1 54.1,35.8 52.5,35.8 52.1,35.4 47.2,35.4 46.8,35.8 46.8,36.93 v46.51,37.22 | v46.21,42.51 45.21,42.51 43.5,40.8 35.22,40.8 v35,41.02 | v24.39,37 24.39,37.39 24.6,37.6 24.6,40.6 v24.3,40.9 24.3,41.3 23.9,41.7 23,41.7 22.8,41.5 21.12,41.5 v21,41.62 | v13.3,43.3 16.2,40.4 v16.2,39.9
CRESET  (via drill 0.33, 0.35)
  Top 0.178: IC1.34 58.3,30.9 56,33.2 56,35.3 v56.4,35.7 | v47.2,37.9 47.2,38 47,38.2 47,43 v46.7,43.3 | U2.44 24,35.68 v23.78,35.9 | v36,41.42 35.72,41.7 32.7,41.7 31.9,40.9 25.3,40.9 24.6,41.6 24,41.6 v23.4,41 | v20.3,41 19.9,41 18.1,39.2 v16.9,39.2 | R5.2 13.77,43.83 14.1,43.5 14.1,43 v13.4,42.3
  Bottom 0.178: v56.4,35.7 56.4,36.3 55.9,36.8 54.5,36.8 53.9,36.2 52.3,36.2 51.9,35.8 47.5,35.8 47.2,36.1 v47.2,37.9 | v46.7,43.3 45.4,43.3 43.3,41.2 36.22,41.2 v36,41.42 | v23.78,35.9 23.78,37.28 24.2,37.7 24.2,38.9 24.2,39.9 23.4,40.7 v23.4,41 v20.3,41 | v13.4,42.3 15.5,40.2 15.5,39.5 15.8,39.2 v16.9,39.2
FBIN0  (via drill 0.35)
  Top 0.178: U2.19 v37.6,28 | v43.5,28 45,28 45.2,27.8 IC1.1
  Bottom 0.178: v37.6,28 v43.5,28
FBIN1  (via drill 0.35)
  Top 0.178: v38.3,27.38 38.22,27.3 37.2,27.3 37,27.5 U2.18 | v44.3,27.38 44.82,27.38 45.2,27 IC1.2
  Bottom 0.178: v38.3,27.38 v44.3,27.38
FBIN2  (via drill 0.35)
  Top 0.178: v43.5,26.5 44.8,26.5 45.1,26.2 IC1.3 | U2.16 37,26.5 37.2,26.7 39.04,26.7 v39.1,26.76
  Bottom 0.152: 43,27 v43.5,26.5
  Bottom 0.178: v39.1,26.76 39.34,27 43,27
FBIN3  (via drill 0.35)
  Top 0.178: v44.2,25.88 44.62,25.88 45.1,25.4 IC1.4 | U2.15 37.1,26 37.18,26.08 v38.3,26.08
  Bottom 0.178: v44.2,25.88 43.22,25.88 42.5,26.6 39.9,26.6 39.38,26.08 v38.3,26.08
GND  (via drill 0.33, 0.35)
  Top 0.152: 15.69,37.59 v15.7,37.6 | 37.78,36.07 C24.2 | 15.69,11.31 v15.7,11.3 | C25.2
  Top 0.178: U2.70 v21.4,21.5 | U2.55 v21.4,29 | U2.47 v22.5,30.6 | U2.39 v26.5,30.6 | U2.32 v30,30.6 | U2.23 v32.6,30 | U2.17 v32.6,27 | U2.5 v32.6,21 | U2.98 v32,19.4 | U2.84 v25,19.4 | C22.2 C21.2 15.69,37.59 | C23.2 37.78,34.6 | 37.78,34.6 37.78,36.07 | C15.2 C16.2 15.69,11.31 | C26.2 C25.2 | C25.2 v37.9,17.4 | IC1.16 v53.5,20.2 | IC1.29 v57.9,24.6 | IC1.39 v54.3,27.4 | U6.1 v8.2,11.6 | C19.2 v1.8,17.8 | C10.2 v6.8,22.2 | C9.2 4.78,25 v6.8,25 | C20.2 v8,8.8 | C18.2 5.5,32.39 v5.5,30 | C17.2 v12.1,41 | R7.1 13.6,50.45 v13.6,52.6 | 37.78,34.6 v39.3,34.6 | U4.1 v7.8,35.2 | C6.1 42.75,25.05 v42.7,25.1 | C4.2 68.13,13.13 v68.1,13.1 | C3.2 68.37,29.87 v68.4,29.9 | J4.P$7 28.7,3.9 28.95,4.15 C12.2 C11.2 | C5.2 v24.6,8.5 | C14.2 41.47,14.97 v41.5,15 | U3.1 64.78,43.98 v64.8,44 | C1.2 C13.2 43.55,33.1 v45.7,33.1 | v22,48.1 C8.2 C7.2 R6.1
  Bottom 0.178: v7.8,35.2 11.9,35.2
  pour Bottom: 0.64,55.24 70.36,55.24 70.36,0.64 0.64,0.64 0.64,30.73 11.18,30.73 11.18,48.13 0.64,48.13
MISO  (via drill 0.33, 0.35)
  Top 0.178: IC1.43 v51.1,33.5 | v44.6,39.1 44.7,39 44.7,34.88 44.68,34.86 44.68,34.34 44.7,34.32 v44.7,33.8 | U2.45 23.5,34.7 v23,35.2 | v23.3,38.5 23.7,38.9 v33.3,38.9
  Bottom 0.178: v51.1,33.5 50.8,33.8 v44.7,33.8 | v44.6,39.1 44.5,39.2 34.9,39.2 34.4,38.7 33.5,38.7 v33.3,38.9 | v23,35.2 22.7,35.5 22.7,36.4 23,36.7 23,38.2 v23.3,38.5
MODE
  Top 0.178: IC1.33 R9.1
MOSI  (via drill 0.35)
  Top 0.178: IC1.38 55.1,31.1 53.2,33 v53.2,34.2 | v45.1,40 45.3,39.8 45.3,38.7 45.1,38.5 45.1,35.25 45.3,35.05 v45.3,34.6 | v34.1,39.38 33.82,39.38 33.69,39.51 33.01,39.51 32.8,39.3 22.5,39.3 v22.4,39.2 | U2.46 23,34.2 22.3,34.9 22.3,36.9 v22.2,37
  Bottom 0.178: v53.2,34.2 45.7,34.2 v45.3,34.6 | v45.1,40 44.5,40 44.1,39.6 34.8,39.6 34.58,39.38 v34.1,39.38 | v22.2,37 22.2,38 22.4,38.2 v22.4,39.2
N$1
  Top 0.178: IC1.42 51.9,36.8 53,37.9 R3.1
N$2
  Top 0.178: U2.75 14.02,19 D2.C
N$3  (via drill 0.35)
  Top 0.178: R1.2 v25.2,10.9 | v34.2,8.9 v41.5,8.9 | v45.2,10.9 47.8,13.5 49.9,13.5 v50.2,13.8 | IC1.18 55.1,15.7 v54.8,15.4
  Bottom 0.178: v25.2,10.9 32.2,10.9 v34.2,8.9 | v41.5,8.9 43.2,8.9 v45.2,10.9 | v50.2,13.8 50.4,14 51.7,14 51.9,13.8 53.5,13.8 54.8,15.1 v54.8,15.4
N$4
  Top 0.178: IC1.11 R8.2
N$5
  Top 0.178: IC1.7 C6.2
N$8
  Top 0.178: R7.2 16.74,50.4 LED1.C
N$11
  Top 0.178: R9.2 65.39,27.74 LED3.C
PGC  (via drill 0.35)
  Top 0.178: J7.P$5 20.41,3.9 25.2,3.9 v25.4,4.1 | v33.5,5 34.2,5.7 v41.3,5.7 | v46.8,9.9 46.8,11 48.4,12.6 v51.8,12.6 | v56.6,14.8 56.7,14.9 IC1.20
  Bottom 0.178: v25.4,4.1 32.6,4.1 v33.5,5 | v41.3,5.7 43.8,5.7 46.8,8.7 v46.8,9.9 | v51.8,12.6 52.2,13 54,13 55.8,14.8 v56.6,14.8
PGD  (via drill 0.35)
  Top 0.178: J7.P$4 18.27,4.3 24.2,4.3 v24.5,4.6 | v32.4,4.9 33.6,6.1 40.2,6.1 v40.5,6.4 | v46.1,9.2 46.1,10.9 48.2,13 50.6,13 50.9,13.3 v51.1,13.3 | v55.9,15.5 IC1.19
  Bottom 0.178: v24.5,4.6 24.7,4.8 25.7,4.8 26,4.5 32,4.5 v32.4,4.9 | v40.5,6.4 41.6,6.4 41.9,6.1 43.5,6.1 46.1,8.7 v46.1,9.2 | v51.1,13.3 51.2,13.4 53.8,13.4 v55.9,15.5
REFO  (via drill 0.35)
  Top 0.178: U2.13 37.4,25 v38.3,24.1 | v40.5,19.8 R8.1
  Bottom 0.178: v38.3,24.1 40.5,21.9 v40.5,19.8
SCK  (via drill 0.33, 0.35)
  Top 0.178: IC1.37 55.9,31 54,32.9 v54,34.7 | v45.71,35.5 45.51,35.7 45.5,35.7 45.5,38.4 45.8,38.7 45.8,40.54 v45.52,40.82 | v33.3,40.12 32.92,40.12 32.5,39.7 23.9,39.7 23.7,39.9 22,39.9 | U2.48 22,34.5 21.7,34.8 21.7,36.02 v21.52,36.2 | 22,39.9 | 22,39.9 21.61,39.51 v21.61,38.6
  Bottom 0.178: v54,34.7 53.8,34.9 52.8,34.9 52.5,34.6 46.7,34.6 45.8,35.5 v45.71,35.5 | v45.52,40.82 45.5,40.8 44.7,40.8 43.9,40 33.42,40 v33.3,40.12 | v21.52,36.2 21.52,38.51 v21.61,38.6
USB-D+  (via drill 0.35)
  Top 0.178: IC1.8 49.9,22.2 v51.4,23.7 | v54.7,25.2 57,27.5 v57.2,27.5 | v59.7,29.8 v59.7,35.7 | v57,42.3 57,46.8 | v57,47.5 57,47 57,46.8 | U3.3 v58.6,44.9 | v55.8,44.9 55.8,45.6 57,46.8
  Bottom 0.178: v51.4,23.7 53.2,23.7 v54.7,25.2 | v57.2,27.5 57.4,27.5 v59.7,29.8 | v59.7,35.7 57,38.4 v57,42.3 | v57,47.5 57,48.4 57.9,49.3 57.9,52.08 J2.P$6 | v58.6,44.9 v55.8,44.9
USB-D-  (via drill 0.35)
  Top 0.178: IC1.9 49.7,21.4 51.2,22.9 52.1,22.9 v52.2,23 | v55.7,25.2 55.7,25.6 56.9,26.8 57.7,26.8 v58.3,27.4 | v60.5,30.7 60.5,30.9 60.1,31.3 60.1,35 60.4,35.3 60.4,36.3 v60.1,36.6 | v57.7,41.6 57.7,42.6 57.4,42.9 57.4,46.8 57.7,47.1 57.7,48.1 v58,48.4 | U3.2 62.6,46.7 v60,49.3
  Bottom 0.178: v52.2,23 53.1,23 54.4,24.3 54.8,24.3 v55.7,25.2 | v58.3,27.4 58.3,27.8 59.6,29.1 60.1,29.1 60.5,29.5 v60.5,30.7 | v60.1,36.6 59.4,36.6 57.4,38.6 57.4,41.3 v57.7,41.6 | v58,48.4 58.9,49.3 v60,49.3 60.5,49.8 60.5,52.02 J2.P$4
VBUS
  pour Top: 70.35,31 52.8,31 52.8,55.2 70.35,55.2
VCCINT  (via drill 0.33)
  Top 0.178: U6.3 7.6,14.6 v8.6,15.6 | v12.8,15.6 14.77,15.6 | C19.1 7.9,17.8 v8.6,17.1
  Bottom 0.178: v12.8,15.6 v8.6,15.6 v8.6,17.1
  pour Top: 14.48,37.21 18.8,37.21 18.8,35.31 20.83,33.02 32.89,33.02 34.8,34.92 34.8,37.21 38.99,37.21 38.99,32.13 36.83,32.13 35.31,30.61 35.31,18.41 36.83,16.89 39.12,16.89 39.12,11.81 34.8,11.81 34.8,14.1 32.49,16.8 21.4,16.7 18.8,14.1 18.8,11.81 14.35,11.81 14.35,16.89 16.76,16.89 18.91,19.04 18.91,30.01 16.89,32.13 14.48,32.13
VDD
  Top 0.178: C18.1 3.56,28.96 3.5,28.9 | U4.3 11.9,38.2
  pour Top: 0.64,0.64 0.76,29.72 11.3,29.59 11.3,38.48 13.72,38.48 13.72,31.5 16.26,31.5 18.28,29.47 18.38,19.52 16.38,17.53 13.72,17.53 13.72,0.64
  pour Top: 11.3,55.24 11.3,37.85 19.43,37.85 19.43,35.56 21.34,33.53 32.13,33.53 34.16,35.56 34.16,37.85 39.62,37.85 39.62,29.91 52.01,30.01 52.01,55.24
  pour Top: 0.64,12.45 13.72,12.45 13.72,11.18 19.43,11.18 19.43,13.72 21.88,16.17 31.98,16.17 34.04,13.72 34.04,11.18 39.75,11.18 39.75,17.53 37.21,17.53 35.81,18.92 35.81,29.97 37.34,31.5 39.62,31.5 39.62,30.4 70.36,30.37 70.36,23.08 53.26,23.08 53.3,12.11 49.8,9.04 46.15,6.1 46.15,0.64 0.64,0.64

### Text on the board
tNames: HW 0001 | R 002